# Altium schematic sheet Monarch.SchDoc
size A
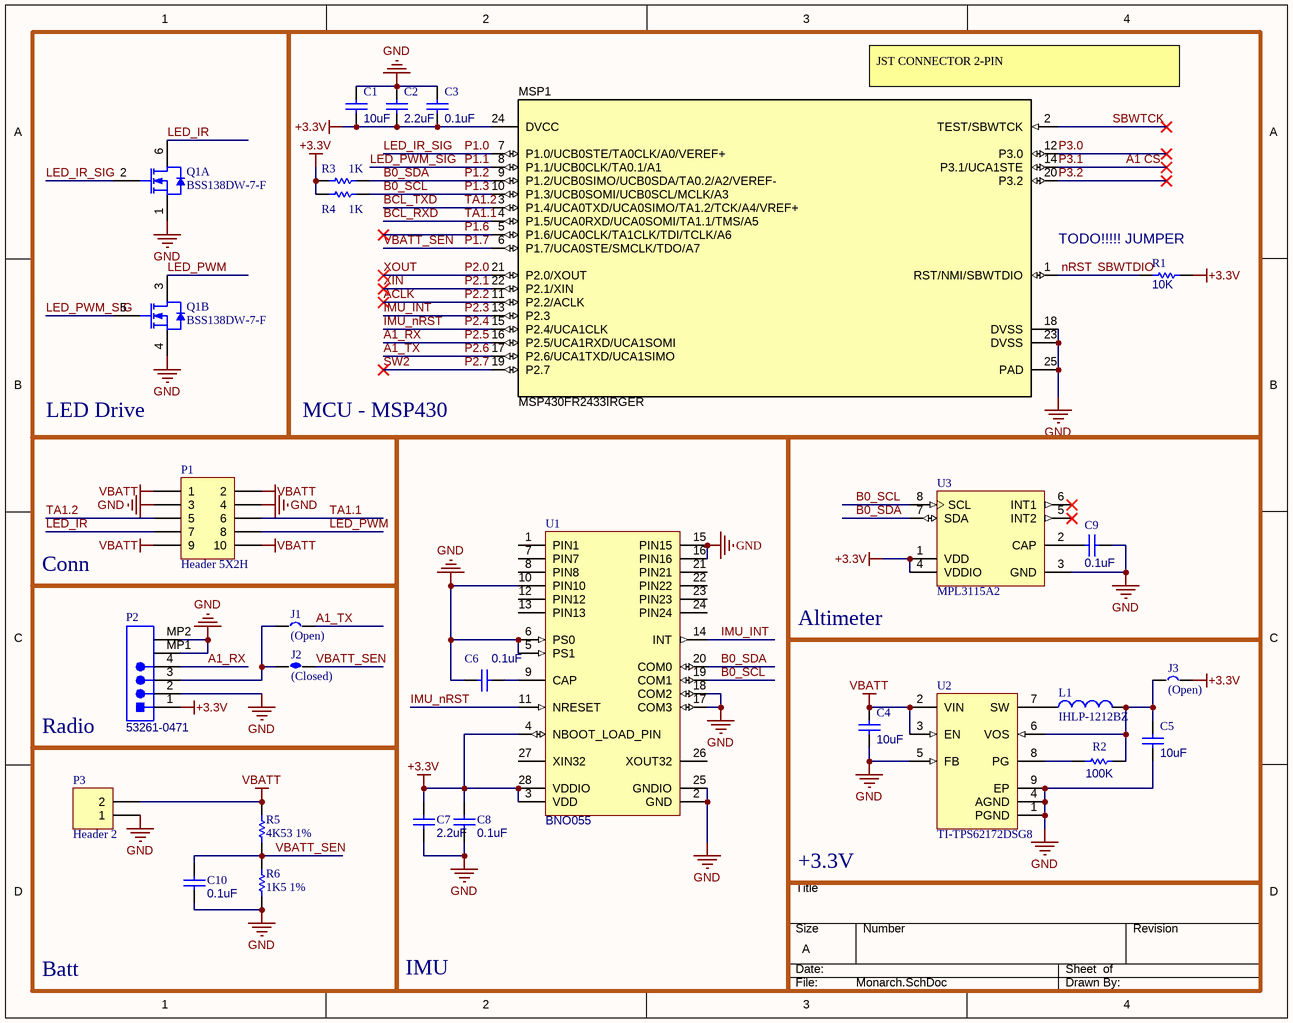
[diagram p0: Monarch.SchDoc]

## Parts
C1  10uF  [CAPC0805(2012)100_L]
C2  2.2uF  [CAPC0603(1608)100_L]
C3  0.1uF  [CAPC0402(1005)60_L]
C4  10uF  [CAPC0805(2012)100_L]
C5  10uF  [CAPC0805(2012)100_L]
C6  0.1uF  [CAPC0402(1005)60_L]
C7  2.2uF  [CAPC0603(1608)100_L]
C8  0.1uF  [CAPC0402(1005)60_L]
C9  0.1uF  [CAPC0402(1005)60_L]
C10  0.1uF  [CAPC0402(1005)60_L]
J1  (Open)  [Solder Jumper]
J2  (Closed)  [Solder Jumper - Closed]
J3  (Open)  [Solder Jumper]
L1  IHLP-1212BZ  [IHLP-1212BZ]
MSP1  MSP430FR2433IRGER  [RGE0024H]
P1  Header 5X2H  [HDR2X5H]
P2  53261-0471  [MOLEX-53261-0471_V]
P3  Header 2  [HDR1X2]
Q1  BSS138DW-7-F  [DIOD-SOT363-6_V]  (parts A,B of 2)
R1  10K  [RESC0402(1005)_L]
R2  100K  [RESC0402(1005)_L]
R3  1K  [RESC0402(1005)_L]
R4  1K  [RESC0402(1005)_L]
R5  4K53 1%  [RESC0402(1005)_L]
R6  1K5 1%  [RESC0402(1005)_L]
U1  BNO055  [BOSC-LGA-28_N]
U2  TI-TPS62172DSG8  [DSG0008A_V]
U3  MPL3115A2  [FRES-2153-01_V]

## Blocks framed on the sheet
LED Drive: Q1
MCU - MSP430: C1-C3 MSP1 R1 R3 R4
IMU: C6-C8 U1
Altimeter: C9 U3
+3.3V: C4 C5 J3 L1 R2 U2

## Nets
+3.3V: C1.1 C2.1 C3.1 C7.2 C8.2 J3.2 MSP1.24(DVCC) P2.1 R1.2 R3.1 R4.1 U1.3(VDD) U1.4(NBOOT_LOAD_PIN) U1.28(VDDIO) U3.1(VDD) U3.4(VDDIO)
GND: C1.2 C2.2 C3.2 C4.1 C5.1 C6.2 C7.1 C8.1 C9.1 C10.2 MSP1.18(DVSS) MSP1.23(DVSS) MSP1.25(PAD) P1.3 P1.4 P2.2 P2.MP1 P2.MP2 P3.1 Q1.1(S1) Q1.4(S2) R6.1 U1.2(GND) U1.5(PS1) U1.6(PS0) U1.10(PIN10) U1.15(PIN15) U1.16(PIN16) U1.17(COM3) U1.18(COM2) U1.25(GNDIO) U2.1(PGND) U2.4(AGND) U2.5(FB) U2.9(EP) U3.3(GND)
VBATT: C4.2 P1.1 P1.2 P1.9 P1.10 P3.2 R5.2 U2.2(VIN) U2.3(EN)
A1 CS: MSP1.14(P3.1/UCA1STE)  [also labelled P3.1]
A1_RX: MSP1.16(P2.5/UCA1RXD/UCA1SOMI) P2.4  [also labelled P2.5]
A1_TX: J1.2 MSP1.17(P2.6/UCA1TXD/UCA1SIMO)  [also labelled P2.6]
ACLK: MSP1.11(P2.2/ACLK)  [also labelled P2.2]
B0_SCL: MSP1.10(P1.3/UCB0SOMI/UCB0SCL/MCLK/A3) R4.2 U1.19(COM1) U3.8(SCL)  [also labelled P1.3]
B0_SDA: MSP1.9(P1.2/UCB0SIMO/UCB0SDA/TA0.2/A2/VEREF-) R3.2 U1.20(COM0) U3.7(SDA)  [also labelled P1.2]
BCL_RXD: MSP1.4(P1.5/UCA0RXD/UCA0SOMI/TA1.1/TMS/A5) P1.6  [also labelled TA1.1]
BCL_TXD: MSP1.3(P1.4/UCA0TXD/UCA0SIMO/TA1.2/TCK/A4/VREF+) P1.5  [also labelled TA1.2]
IMU_INT: MSP1.13(P2.3) U1.14(INT)  [also labelled P2.3]
IMU_nRST: MSP1.15(P2.4/UCA1CLK) U1.11(NRESET)  [also labelled P2.4]
LED_IR: P1.7 Q1.6(D1)
LED_IR_SIG: MSP1.7(P1.0/UCB0STE/TA0CLK/A0/VEREF+) Q1.2(G1)  [also labelled P1.0]
LED_PWM: P1.8 Q1.3(D2)
LED_PWM_SIG: MSP1.8(P1.1/UCB0CLK/TA0.1/A1) Q1.5(G2)  [also labelled P1.1]
nRST: MSP1.1(RST/NMI/SBWTDIO) R1.1  [also labelled SBWTDIO]
P1.6: MSP1.5(P1.6/UCA0CLK/TA1CLK/TDI/TCLK/A6)
P1.7: C10.1 J2.2 MSP1.6(P1.7/UCA0STE/SMCLK/TDO/A7) R5.1 R6.2  [also labelled VBATT_SEN]
P2.0: MSP1.21(P2.0/XOUT)  [also labelled XOUT]
P2.1: MSP1.22(P2.1/XIN)  [also labelled XIN]
P2.7: MSP1.19(P2.7)  [also labelled SW2]
P3.0: MSP1.12(P3.0)
P3.2: MSP1.20(P3.2)
SBWTCK: MSP1.2(TEST/SBWTCK)
NetC5_2: C5.2 J3.1 L1.2 R2.2 U2.6(VOS)
NetC6_1: C6.1 U1.9(CAP)
NetC9_2: C9.2 U3.2(CAP)
NetJ1_1: J1.1 J2.1 P2.3
NetL1_1: L1.1 U2.7(SW)
NetR2_1: R2.1 U2.8(PG)

Not connected (* = marked no-connect by the designer): U1 1(PIN1) 7(PIN7) 8(PIN8) 12(PIN12) 13(PIN13) 21(PIN21) 22(PIN22) 23(PIN23) 24(PIN24) 26(XOUT32) 27(XIN32); U3 5(INT2)* 6(INT1)*

## Notes on the sheet
- (near MSP1) JST CONNECTOR 2-PIN
- TODO!!!!! JUMPER
- Conn
- Radio
- Batt

## Library data of the parts
C1 C4 C5 = CMP-1036-04928-1: CAP 10uF 16V ±10% 0805 (2012 Metric) Thickness 1mm SMD; Tolerance: Â±10%; Case-Metric: 2012; Case-EIA: 0805; Rated Voltage: 16 V; Technology: SMT; Max Thickness: 1 mm; Value: 10uF
C2 C7 = CMP-1035-02763-1: CAP 2.2uF 16V ±10% 0603 (1608 Metric) Thickness 1mm SMD; Case-Metric: 1608; Case-EIA: 0603; Tolerance: Â±10%; Value: 2.2uF; Max Thickness: 1 mm; Technology: SMT; Rated Voltage: 16 V
C3 C6 C8-C10 = CMP-1034-02069-1: CAP 100nF 16V ±10% 0402 (1005 Metric) Thickness 0.6mm SMD; Case-EIA: 0402; Case-Metric: 1005; Tolerance: Â±10%; Value: 100nF; Max Thickness: 0.6 mm; Rated Voltage: 16 V; Technology: SMT
J1 J3 = Jumper
J2 = Jumper Closed: Jumper
L1 = IHLP-1212BZ: IHLP-1212BZ / 2.2uH; Code_IEC: 1005; Published: 8-Jun-2000; LatestRevisionDate: 29-May-2009; LatestRevisionNote: IPC-7351 Footprint Added.; PackageReference: 0402-A; Publisher: Altium Limited; PackageDescription: Chip Inductor; Code_JEITA: 0402
MSP1 = MSP430FR2433IRGER: MSP430FR2433 16 MHz Ultra-Low-Power Microcontroller with 16 KB FRAM, 4 KB RAM, 19 IO, 4 Timers, RGE0024H (VQFN-24); Alternate PartNumber: MSP430FR2433IRGET; Manufacturer: Texas Instruments; SymbolCreator: Altium; SizeArea_mm2: 16; SizeAreaWB_mm2: 25; SizeX_mm: 4; SizeZ_mm: 1; CompType: IC; U/M: EA; Note: TI Provided; SymbolVersion: 2015-09-16; PartNumber: MSP430FR2433IRGER; PackageReference: RGE0024H; PackageDescription: VQFN-24; MountType: SMT; SizeY_mm: 4; ComponentLink1Description: Datasheet Link; ComponentLink1URL: http://www.ti.com/lit/ds/symlink/msp430fr2433.pdf; Publisher: Texas Instruments; LatestRevisionDate: 2017-03-06; Alternate Manufacturer: Texas Instruments
P1 = Header 5X2H: Header, 5-Pin, Dual row, Right Angle; LatestRevisionDate: 17-Jul-2002; LatestRevisionNote: Re-released for DXP Platform.; Publisher: Altium Limited
P2 = CMP-2000-05238-1: Male Header, Pitch 1.25 mm, 1 x 4 Position, Height 3.4 mm, -40 to 85 degC, RoHS, Tape and Reel; Current Rating: 1A; Brand: Molex; Number of Positions / Contacts: 4; Pitch: 1.25mm; Voltage Rating: 125V; Mounting Angle: Right; Manufacturer URL: http://www.molex.com/; Factory Pack Quantity: 1000; Housing Material: Thermoplastic; Datasheet URL: http://www.molex.com/pdm_docs/sd/532610471_sd.pdf; Tradename: PicoBlade; Product Type: Headers; Contact Plating: Tin; Contact Material: PhosphorBronze; Package Description: 1.25mm Pitch PicoBlade(TM) Header, Surface Mount, Right Angle, Lead-Free, 4 Circuits; Mounting Style: SMD/SMT; Manufacturer: Molex; Series: 53261; Packaging: Reel; Number of Rows: 1; RoHS: Details; Number of Positions: 4; Product Category: Headers&WireHousings; Datasheet Version: Rev. G, 01/2012; Type: Shrouded; Termination Style: SMD
P3 = Header 2: Header, 2-Pin; LatestRevisionDate: 17-Jul-2002; LatestRevisionNote: Re-released for DXP Platform.; Publisher: Altium Limited
Q1 = CMP-2000-05966-2: Dual N-Channel Enhancement Mode Field Effect Transistor, 50 V, 200 mA, -55 to 150 degC, 6-Pin SOT-363, RoHS, Tape and Reel; Manufacturer: DiodesIncorporated; RevisionId: 1; Transistor Type: 2N-Channel; Typical Turn-On Delay Time: 20ns; Pd - Power Dissipation: 200mW; Vds - Drain-Source Breakdown Voltage: 50V; Unit Weight: 0.000212oz; Folder: Unified Components\Components\New Releases\New\; ContentType: Unified Component; Id - Continuous Drain Current: 200mA; Vgs - Gate-Source Voltage: 20V; AccessRights: 2147483647; Rds On - Drain-Source Resistance: 3.5Ohms; Number of Channels: 2Channel; ReleaseDate: 30/08/2017 08:55:44 AM; Width: 1.35mm; Manufacturer URL: http://www.diodes.com/; Height: 1mm; LifeCycle: Released; Mounting Technology: SurfaceMount; Product: MOSFETSmallSignal; RoHS: True; ItemGUID: D038B86C-7A34-4742-AE06-400EAE30903C; Mounting Style: SMD/SMT; FolderGUID: B7F4506A-9127-42E7-A087-46FE7B18D116; LifeCycleStateGUID: 61E382EE-6656-4F12-9E24-BE9327104A25; Package Reference: SOT363-6; Minimum Operating Temperature: -55C; Datasheet URL: http://www.diodes.com/_files/datasheets/ds30203.pdf; Series: BSS138; Product Category: MOSFET; Brand: DiodesIncorporated; Packaging: Reel; Configuration: Dual; Package / Case: SOT-363-6; ItemHRID: CMP-2000-05966; Typical Turn-Off Delay Time: 20ns; Factory Pack Quantity: 3000; Transistor Polarity: N-Channel; Package Description: 6-Pin Small Outline Transistor, Body 1.25 x 2 mm, Pitch 0.65 mm; Maximum Operating Temperature: +150C; Channel Mode: Enhancement; Technology: Si; Length: 2.2mm; Datasheet Version: Rev. 13-2, 01/2014; ContentTypeGUID: CB3C11C4-E317-11DF-B822-12313F0024A2
R1 = CMP-1011-00623-1: 10K 0.063W 1% 0402 (1005 Metric)  SMD; Case-Metric: 1005; Value: 10000.00 Ohm; Case-EIA: 0402; Tolerance: 1 %; Technology: SMT; Power: 0.063 W
R2 = CMP-1011-00736-1: 100K 0.063W 1% 0402 (1005 Metric)  SMD; Value: 100000.00 Ohm; Case-EIA: 0402; Case-Metric: 1005; Power: 0.063 W; Tolerance: 1 %; Technology: SMT
R3 R4 = CMP-1011-00510-1: 1K 0.063W 1% 0402 (1005 Metric)  SMD; Case-EIA: 0402; Value: 1000.00 Ohm; Case-Metric: 1005; Technology: SMT; Tolerance: 1 %; Power: 0.063 W
R5 = CMP-1011-00584-1: 4K53 0.063W 1% 0402 (1005 Metric)  SMD; Case-EIA: 0402; Value: 4530.00 Ohm; Case-Metric: 1005; Power: 0.063 W; Technology: SMT; Tolerance: 1 %
R6 = CMP-1011-00528-1: 1K5 0.063W 1% 0402 (1005 Metric)  SMD; Case-Metric: 1005; Case-EIA: 0402; Value: 1500.00 Ohm; Tolerance: 1 %; Power: 0.063 W; Technology: SMT
U1 = CMP-2000-05075-1: Intelligent 9-Axis Absolute Orientation Sensor, 1.7 V to 3.6 V, -40 to 85 degC, 28-Pin LGA, RoHS, Tape and Reel; Manufacturer: Bosch Sensortec; Manufacturer URL: http://www.bosch-sensortec.com; Datasheet URL: http://datasheet.octopart.com/BNO055-Bosch-datasheet-45840915.pdf; Datasheet Version: Rev. 1.3, 08/2015
U2 = TI-TPS62172DSG8-1600X900TP
U3 = CMP-1261-00002-2: Xtrinsic I2C Precision Altimeter, 1.95 to 3.6 V, -40 to 85 degC, 8-Pin LGA (2153-01), RoHS, Tray; Manufacturer: Freescale Semiconductor; fSCL@400 pF: 400 KHz Max.; VDDIO: 1.62 to 3.6 V; fSCL@20 pF: 4 MHz Max.; Operating Temperature Range: -40 to 85 degC; PackageDescription: 8-Pin Land Grid Array, Body 5 x 3 mm, Pitch 1.25 mm; Packing: Tray; ComponentLink1Description: Manufacturer URL; ComponentLink2Description: Datasheet; ComponentLink3URL: http://cache.freescale.com/files/shared/doc/package_info/98ASA00260D.pdf; RoHS: TRUE; Mounting Technology: Surface Mount; ComponentLink3Description: Package Specification; VDD: 1.95 to 3.6 V; ComponentLink1URL: http://www.freescale.com/; DatasheetVersion: Rev. 3.0; PartNumber: MPL3115A2; ComponentLink2URL: http://cache.freescale.com/files/sensors/doc/data_sheet/MPL3115A2.pdf; PackageVersion: Rev. O